# EAGLE design UH_006 (EAGLE 7.3.0)
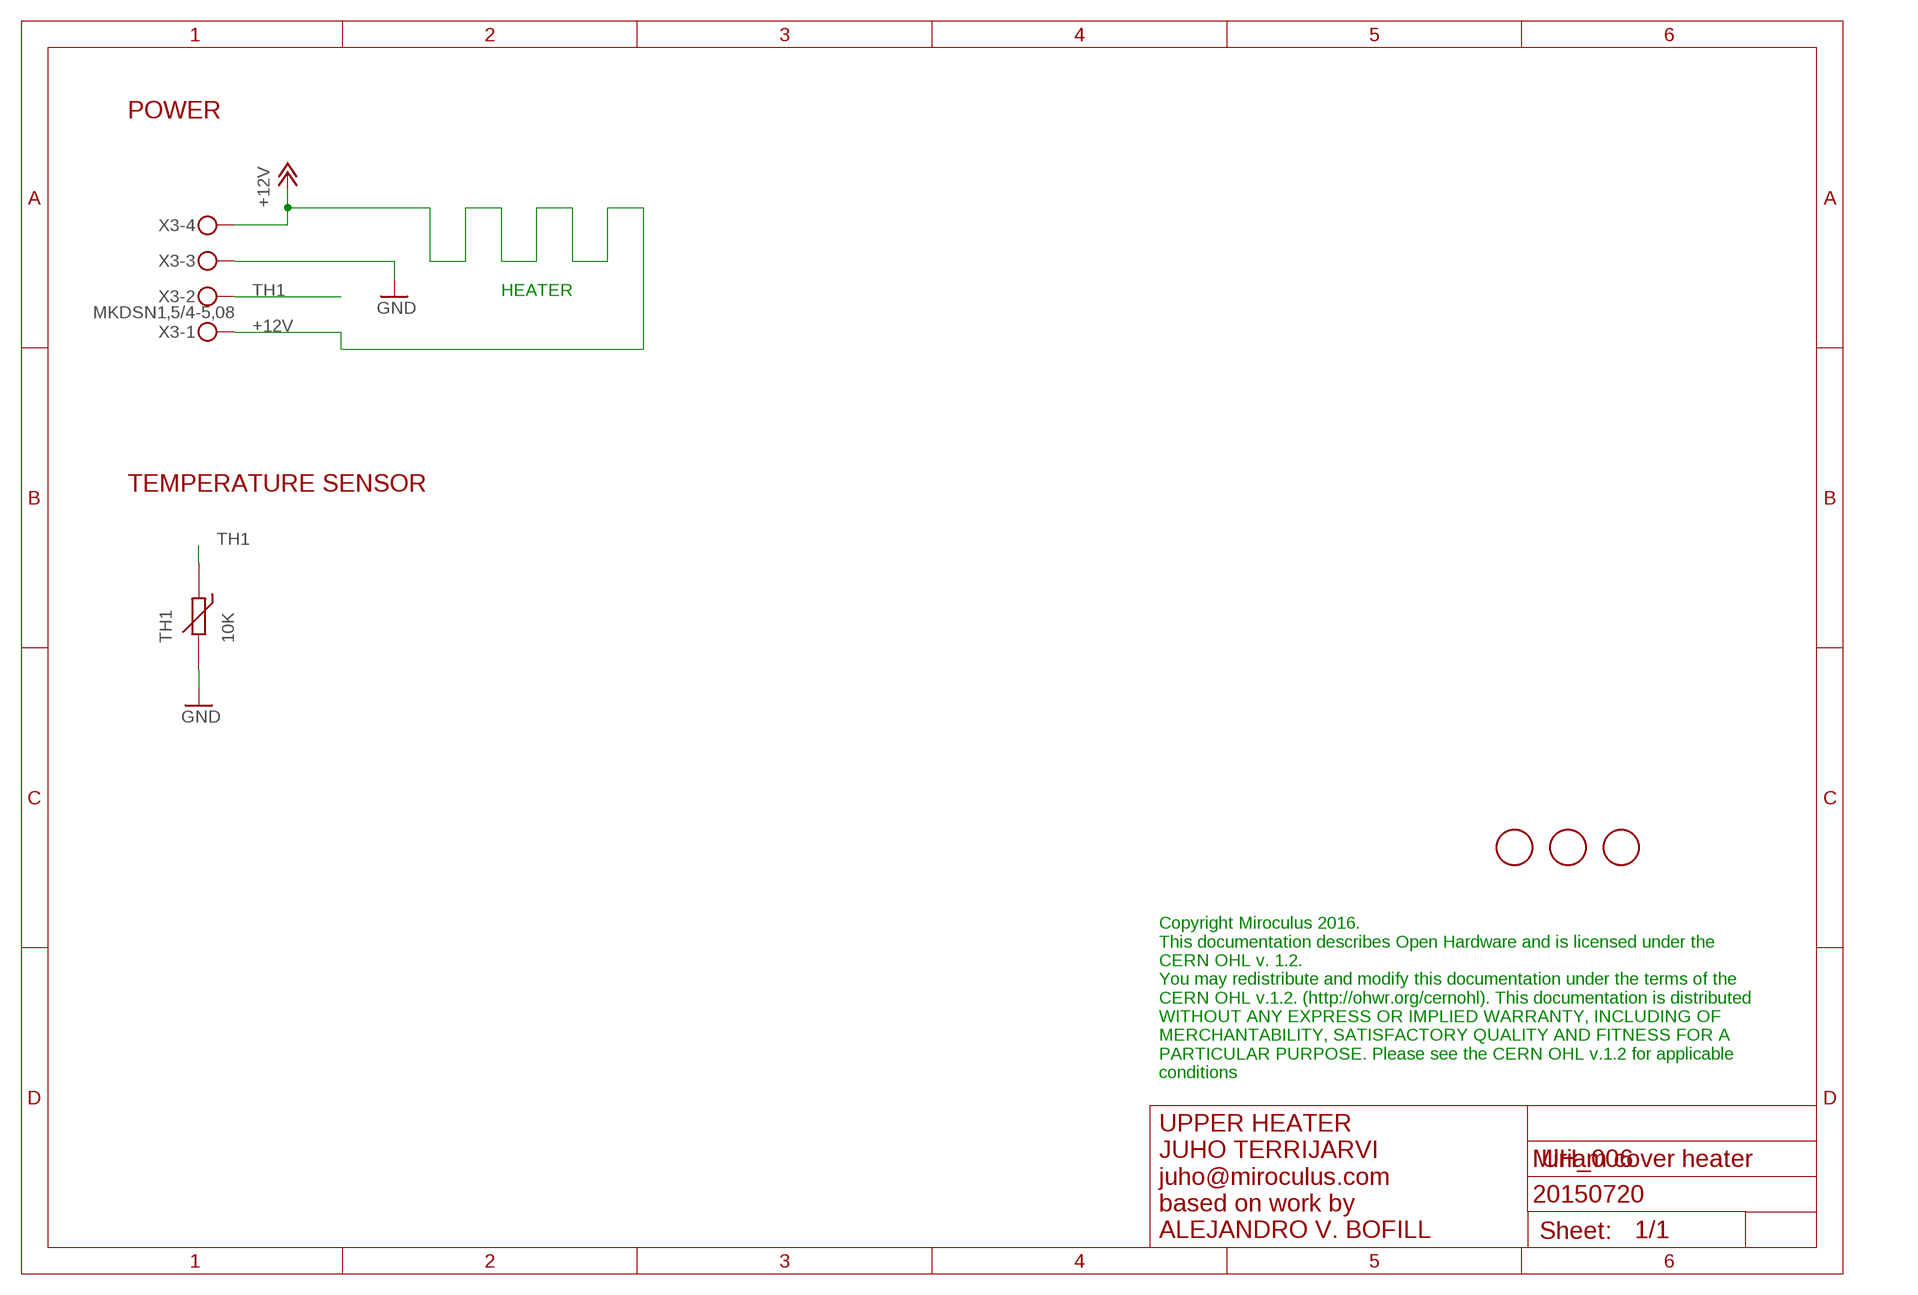
[diagram p0: schematic, sheet 1]

## Parts
FD1  FIDUCIALMOUNT  [FIDUCIA-MOUNT]
FD2  FIDUCIALMOUNT  [FIDUCIA-MOUNT]
FD3  FIDUCIALMOUNT  [FIDUCIA-MOUNT]
TH1  10K  THERMISTOR_SMD_0603  [THERMISTOR_SMD_0603]
X3  MKDSN1,5/4-5,08  [MKDSN1,5/4-5,08]

## Nets
+12V [power12]: X3.1 X3.4
GND: TH1.2 X3.3
TH1: TH1.1 X3.2

## Notes on the sheet
- POWER
- HEATER
- TEMPERATURE SENSOR
- Copyright Miroculus 2016.
  This documentation describes Open Hardware and is licensed under the
  CERN OHL v. 1.2.
  You may redistribute and modify this documentation under the terms of the
  CERN OHL v.1.2. (http://ohwr.org/cernohl). This documentation is distributed
  WITHOUT ANY EXPRESS OR IMPLIED WARRANTY, INCLUDING OF
  MERCHANTABILITY, SATISFACTORY QUALITY AND FITNESS FOR A
  PARTICULAR PURPOSE. Please see the CERN OHL v.1.2 for applicable
  conditions
- UPPER HEATER
  JUHO TERRIJARVI
  juho@miroculus.com
  based on work by
  ALEJANDRO V. BOFILL
- Miriam cover heater
- 20150720

## Library data of the parts
FD1-FD3 = SmartPrj:FIDUCIALMOUNT
TH1 = Miroculus:THERMISTOR_SMD_0603
X3 = con-phoenix-508:MKDSN1,5/4-5,08: MKDSN 1,5/ 4-5,08 Printklemme Nennstrom: 13,5 A Nennspannung: 250 V Rastermaß: 5,08 mm Polzahl: 4 Anschlussart: Schraubanschluss Montage: Löten Anschlussrichtung Leiter/Platine: 0 ° Artikelnummer: 1729144 Source: http://eshop.phoenixcontact.com .. 1729144.pdf

## Net classes
0 default: width 0.254 mm, drill 0.406 mm, clearance 0.178 mm
1 power: width 0.406 mm, drill 0.813 mm, clearance 0.406 mm
2 gnd: width 0.254 mm, drill 0.406 mm, clearance 0.178 mm
3 power usb: width 0.305 mm, drill 0.406 mm, clearance 0.254 mm
4 power12: width 1.778 mm, drill 0.889 mm, clearance 0.406 mm

## Board
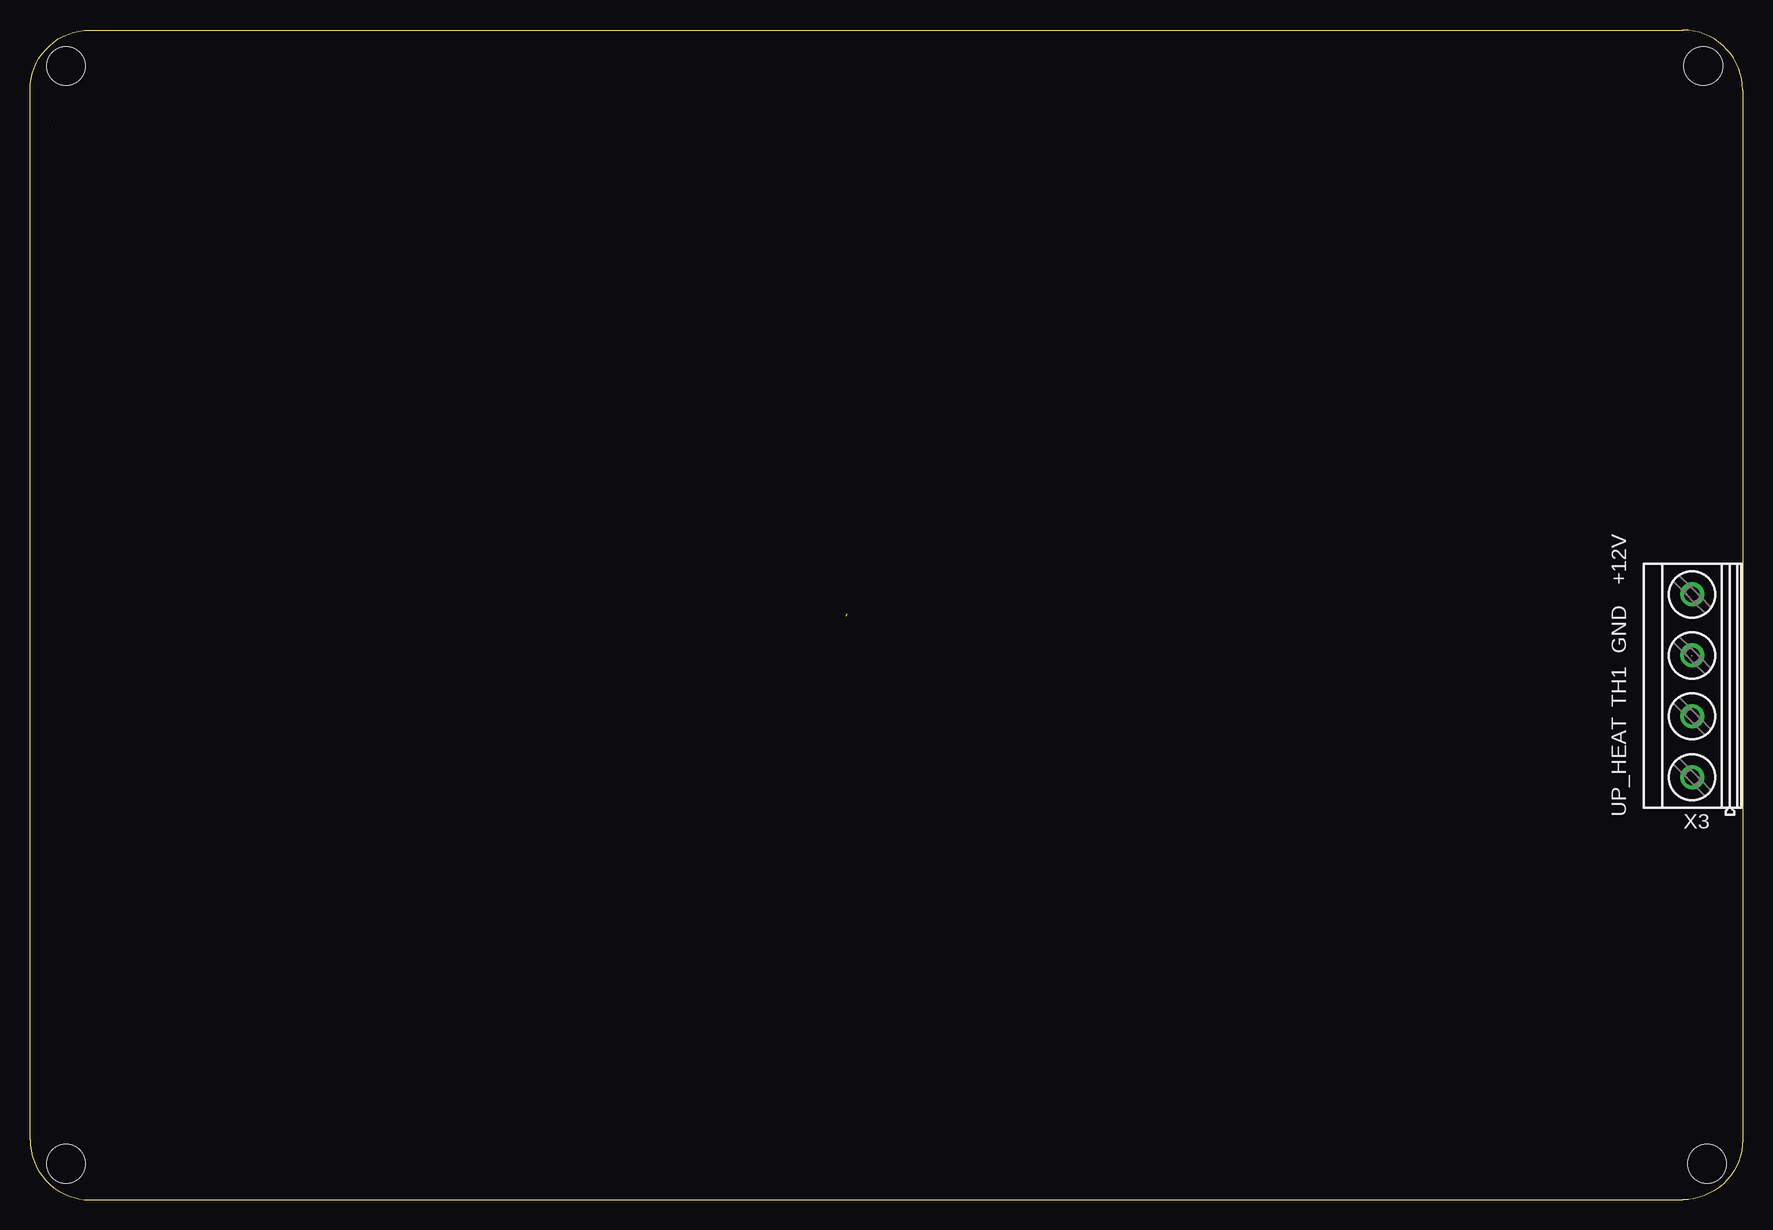
[diagram p1: board, top side]
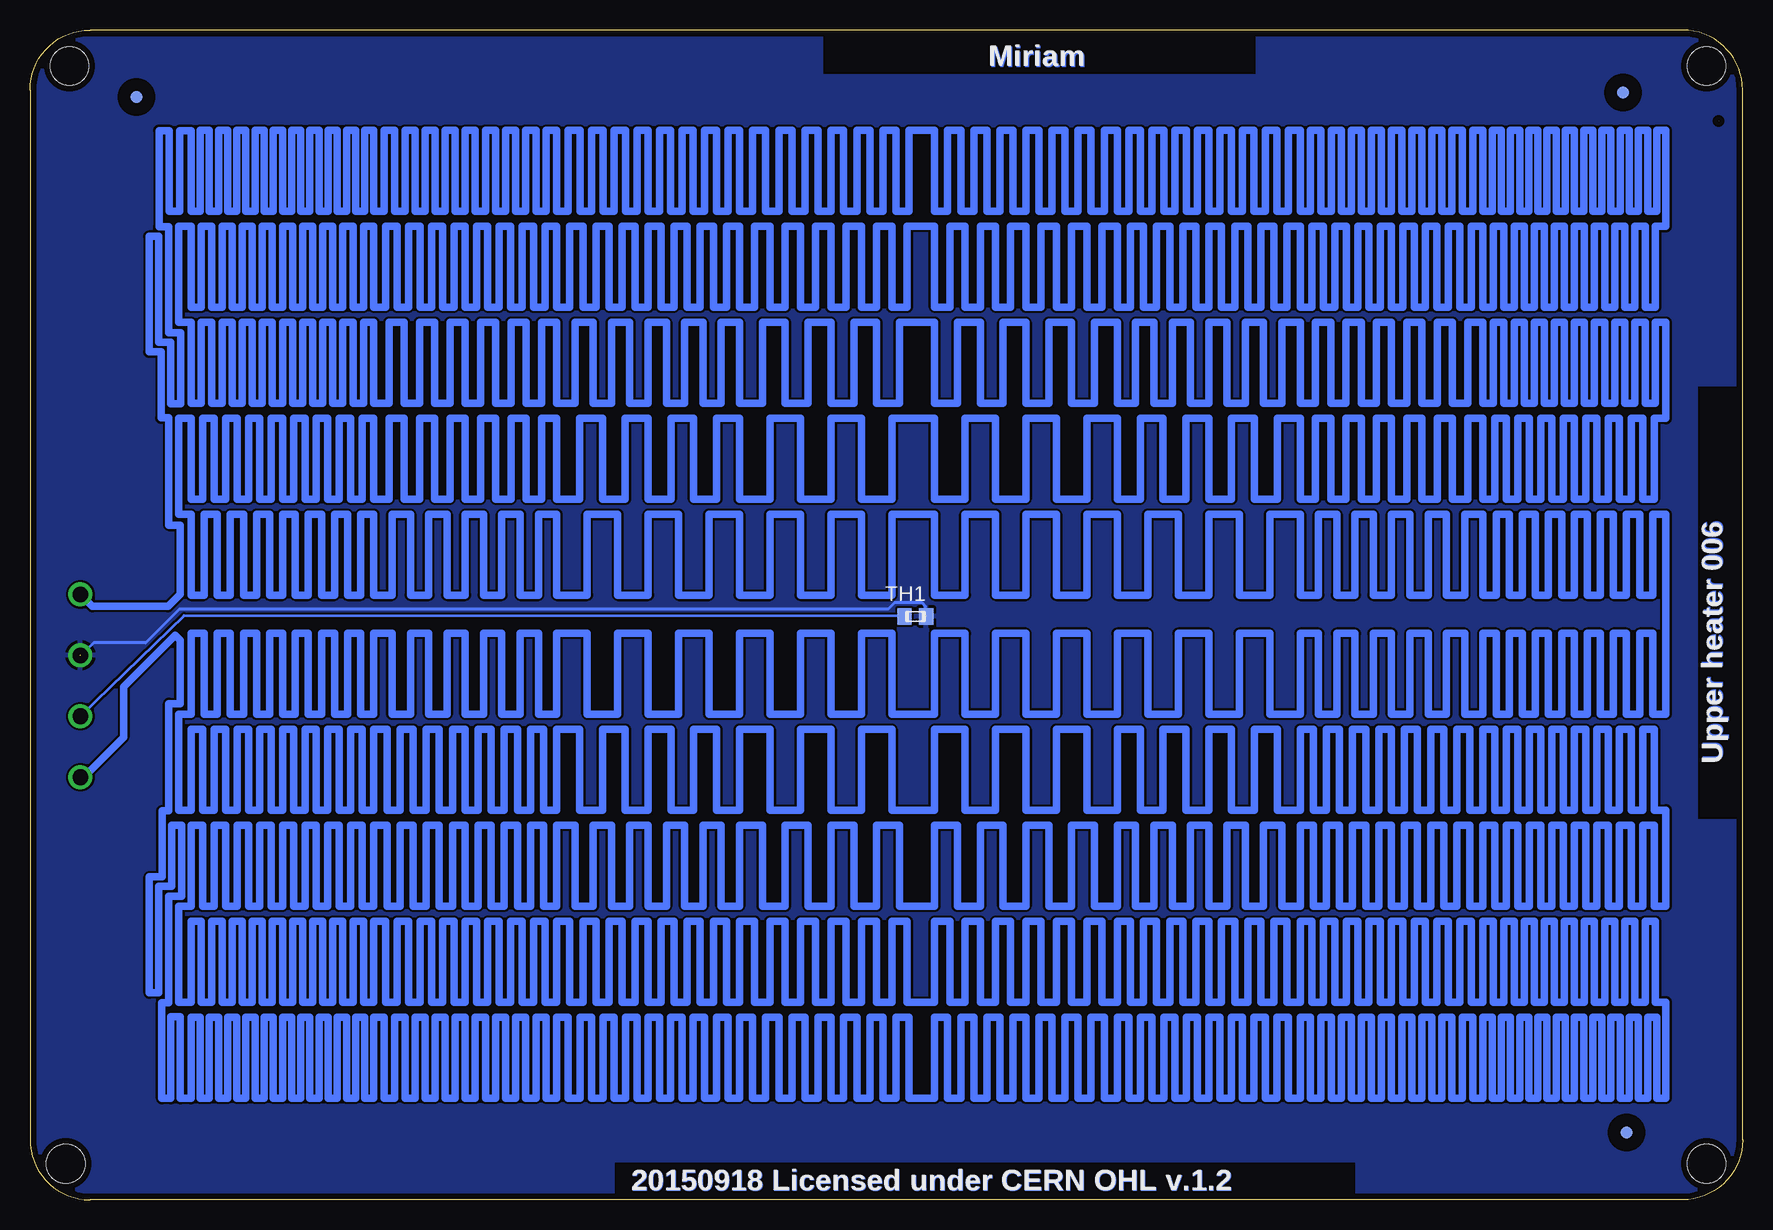
[diagram p2: board, bottom side, seen from below]

Size 142.76 x 97.48 mm. Coordinates in mm from the lower left corner, seen from the top.
Outline: 2.01,89.92 arc0 2.01,89.92
Outline: 0,5 arc90 5,0 137.76,0 arc90 142.76,5 142.76,92.48 arc90 137.76,97.48 5,97.48 arc90 0,92.48 0,5
Copper layers (1*16): Top 0.0178mm / dielectric 59mil / Bottom 0.0178mm
Design rules "SSC-EAGLE-2Lyr_v1.0.0.3": minimum track width 6mil, minimum drill 14mil, track to track 6mil, track to pad 6mil, pad to pad 6mil, via to via 6mil, smd to smd 6mil, copper to edge 20mil, drill to drill 16mil, minimum pad ring 8mil, minimum via ring 8mil, stop-mask expansion 3mil, vias tented up to drill 0mil, thermal gap 10mil
Holes 3.2 mm at 3,94.48 139.48,94.48 139.78,3 3,3
bRestrict: area 40.6,93.8 to 76.6,96.7; area 0.8,31.8 to 3.7,67.7; area 32.3,0.4 to 94,3.1

### Footprints (pad centres in the part's own frame; a part is rotated, then mirrored left to right if it is on the bottom)
FIDUCIA-MOUNT = smd 1.016 x 1.016: P$1 0,0
THERMISTOR_SMD_0603 = smd 1.181 x 1.378: 1 -0.9,0; 2 0.9,0
MKDSN1,5/4-5,08 = drill 1.3 pad 2: 1 -7.641,0.025; 2 -2.561,0.025; 3 2.519,0.025; 4 7.599,0.025

### Placement (x,y rotation side)
FD1  9.67,5.62 0 bottom
FD2  9.96,92.29 0 bottom
FD3  133.89,91.91 0 bottom
TH1  68.96,48.62 0 bottom
X3  138.58,42.85 90 top

### Tracks (layer width: path | path; a pad name or v marks a point on that pad's centre or on a via)
+12V
  Bottom 0.635: X3.1 138.3,35.21 134.95,38.56 134.95,42.75 130.66,47.04 130.23,46.61 130.23,41.35 131.19,41.35 131.19,32.41 131.75,32.41 131.75,26.9 132.82,26.9 132.82,17.25 132.03,17.25 132.03,26.11 130.94,26.11 130.94,31.22 130.12,31.22 130.12,25.3 131.19,25.3 131.19,16.43 131.78,16.43 131.78,8.46 131.01,8.46 131.01,15.24 130.23,15.24 130.23,8.46 129.34,8.46 129.34,15.2 128.57,15.2 128.57,8.47 127.81,8.47 127.81,15.2 127.05,15.2 127.05,8.47 126.29,8.47 126.29,15.2 125.53,15.2 125.53,8.47 124.77,8.47 124.77,15.2 124,15.2 124,8.47 123.24,8.47 123.24,15.2 122.48,15.2 122.48,8.47 121.72,8.47 121.72,15.2 120.95,15.2 120.95,8.47 120.19,8.47 120.19,15.2 119.43,15.2 119.43,8.47 118.67,8.47 118.67,15.2 117.91,15.2 117.91,8.47 117.14,8.47 117.14,15.2 116.38,15.2 116.38,8.47 115.62,8.47 115.62,15.2 114.86,15.2 114.86,8.47 114.1,8.47 114.1,15.2 113.23,15.2 113.23,8.47 112.37,8.47 112.37,15.2 111.51,15.2 111.51,8.47 110.67,8.47 110.67,15.2 109.83,15.2 109.83,8.47 108.99,8.47 108.99,15.2 108.15,15.2 108.15,8.47 107.31,8.47 107.31,15.2 106.48,15.2 106.48,8.47 105.64,8.47 105.64,15.2 104.8,15.2 104.8,8.47 103.96,8.47 103.96,15.2 103.12,15.2 103.12,8.47 102.29,8.47 102.29,15.2 101.45,15.2 101.45,8.47 100.58,8.47 100.58,15.2 99.72,15.2 99.72,8.47 98.86,8.47 98.86,15.2 97.89,15.2 97.89,8.47 96.93,8.47 96.93,15.2 95.96,15.2 95.96,8.47 95,8.47 95,15.2 94.06,15.2 94.06,8.47 93.12,8.47 93.12,15.2 92.18,15.2 92.18,8.47 91.24,8.47 91.24,15.2 90.3,15.2 90.3,8.47 89.36,8.47 89.36,15.2 88.42,15.2 88.42,8.47 87.48,8.47 87.48,15.2 86.51,15.2 86.51,8.47 85.55,8.47 85.55,15.2 84.58,15.2 84.58,8.47 83.62,8.47 83.62,15.2 82.53,15.2 82.53,8.47 81.43,8.47 81.43,15.2 80.34,15.2 80.34,8.47 79.25,8.47 79.25,15.2 78.16,15.2 78.16,8.47 77.06,8.47 77.06,15.2 76,15.2 76,8.47 74.93,8.47 74.93,15.2 73.84,15.2 73.84,8.47 72.75,8.47 72.75,15.2 71.65,15.2 71.65,8.47 70.56,8.47 70.56,15.2 69.47,15.2 69.47,8.47 67.36,8.47 67.36,15.2 66.27,15.2 66.27,8.47 65.18,8.47 65.18,15.2 64.08,15.2 64.08,8.47 62.99,8.47 62.99,15.2 61.9,15.2 61.9,8.47 60.81,8.47 60.81,15.2 59.74,15.2 59.74,8.47 58.67,8.47 58.67,15.2 57.58,15.2 57.58,8.47 56.49,8.47 56.49,15.2 55.4,15.2 55.4,8.47 54.3,8.47 54.3,15.2 53.21,15.2 53.21,8.47 52.12,8.47 52.12,15.2 51.16,15.2 51.16,8.47 50.19,8.47 50.19,15.2 49.23,15.2 49.23,8.47 48.26,8.47 48.26,15.2 47.32,15.2 47.32,8.47 46.38,8.47 46.38,15.2 45.44,15.2 45.44,8.47 44.5,8.47 44.5,15.2 43.56,15.2 43.56,8.47 42.62,8.47 42.62,15.2 41.68,15.2 41.68,8.47 40.74,8.47 40.74,15.2 39.78,15.2 39.78,8.47 38.81,8.47 38.81,15.2 37.85,15.2 37.85,8.47 36.88,8.47 36.88,15.2 36.02,15.2 36.02,8.47 35.15,8.47 35.15,15.2 34.29,15.2 34.29,8.47 33.45,8.47 33.45,15.2 32.61,15.2 32.61,8.47 31.77,8.47 31.77,15.2 30.94,15.2 30.94,8.47 30.1,8.47 30.1,15.2 29.26,15.2 29.26,8.47 28.42,8.47 28.42,15.2 27.58,15.2 27.58,8.47 26.75,8.47 26.75,15.2 25.91,15.2 25.91,8.47 25.07,8.47 25.07,15.2 24.23,15.2 24.23,8.47 23.37,8.47 23.37,15.2 22.5,15.2 22.5,8.47 21.64,8.47 21.64,15.2 20.88,15.2 20.88,8.47 20.12,8.47 20.12,15.2 19.36,15.2 19.36,8.47 18.59,8.47 18.59,15.2 17.83,15.2 17.83,8.47 17.07,8.47 17.07,15.2 16.31,15.2 16.31,8.47 15.54,8.47 15.54,15.2 14.78,15.2 14.78,8.47 14.02,8.47 14.02,15.2 13.26,15.2 13.26,8.47 12.5,8.47 12.5,15.2 11.73,15.2 11.73,8.47 10.97,8.47 10.97,15.2 10.21,15.2 10.21,8.47 9.45,8.47 9.45,15.2 8.69,15.2 8.69,8.47 7.92,8.47 7.92,15.2 7.16,15.2 7.16,8.47 6.4,8.47 6.4,16.47 7.26,16.47 7.26,23.2 8.13,23.2 8.13,16.47 8.99,16.47 8.99,23.2 9.83,23.2 9.83,16.47 10.67,16.47 10.67,23.2 11.51,23.2 11.51,16.47 12.34,16.47 12.34,23.2 13.18,23.2 13.18,16.47 14.02,16.47 14.02,23.2 14.86,23.2 14.86,16.47 15.7,16.47 15.7,23.2 16.54,23.2 16.54,16.47 17.37,16.47 17.37,23.2 18.21,23.2 18.21,16.47 19.05,16.47 19.05,23.2 19.91,23.2 19.91,16.47 20.78,16.47 20.78,23.2 21.64,23.2 21.64,16.47 22.61,16.47 22.61,23.2 23.57,23.2 23.57,16.47 24.54,16.47 24.54,23.2 25.5,23.2 25.5,16.47 26.44,16.47 26.44,23.2 27.38,23.2 27.38,16.47 28.32,16.47 28.32,23.2 29.26,23.2 29.26,16.47 30.2,16.47 30.2,23.2 31.14,23.2 31.14,16.47 32.08,16.47 32.08,23.2 33.02,23.2 33.02,16.47 33.98,16.47 33.98,23.2 34.95,23.2 34.95,16.47 35.92,16.47 35.92,23.2 36.88,23.2 36.88,16.47 37.97,16.47 37.97,23.2 39.06,23.2 39.06,16.47 40.16,16.47 40.16,23.2 41.25,23.2 41.25,16.47 42.34,16.47 42.34,23.2 43.43,23.2 43.43,16.47 44.5,16.47 44.5,23.2 45.57,23.2 45.57,16.47 46.66,16.47 46.66,23.2 47.75,23.2 47.75,16.47 48.84,16.47 48.84,23.2 49.94,23.2 49.94,16.47 51.03,16.47 51.03,23.2 52.12,23.2 52.12,16.47 53.39,16.47 53.39,23.2 54.66,23.2 54.66,16.47 55.93,16.47 55.93,23.2 57.2,23.2 57.2,16.47 58.47,16.47 58.47,23.2 59.74,23.2 59.74,16.47 61.01,16.47 61.01,23.2 62.28,23.2 62.28,16.47 63.55,16.47 63.55,23.2 64.82,23.2 64.82,16.47 66.09,16.47 66.09,23.2 67.36,23.2 67.36,16.47 69.65,16.47 69.65,23.2 70.92,23.2 70.92,16.47 72.19,16.47 72.19,23.2 73.46,23.2 73.46,16.47 74.73,16.47 74.73,23.2 76,23.2 76,16.47 77.27,16.47 77.27,23.2 78.54,23.2 78.54,16.47 79.81,16.47 79.81,23.2 81.08,23.2 81.08,16.47 82.35,16.47 82.35,23.2 83.62,23.2 83.62,16.47 84.71,16.47 84.71,23.2 85.8,23.2 85.8,16.47 86.89,16.47 86.89,23.2 87.99,23.2 87.99,16.47 89.08,16.47 89.08,23.2 90.17,23.2 90.17,16.47 91.24,16.47 91.24,23.2 92.3,23.2 92.3,16.47 93.4,16.47 93.4,23.2 94.49,23.2 94.49,16.47 95.58,16.47 95.58,23.2 96.67,23.2 96.67,16.47 97.77,16.47 97.77,23.2 98.86,23.2 98.86,16.47 99.82,16.47 99.82,23.2 100.79,23.2 100.79,16.47 101.75,16.47 101.75,23.2 102.72,23.2 102.72,16.47 103.66,16.47 103.66,23.2 104.6,23.2 104.6,16.47 105.54,16.47 105.54,23.2 106.48,23.2 106.48,16.47 107.42,16.47 107.42,23.2 108.36,23.2 108.36,16.47 109.3,16.47 109.3,23.2 110.24,23.2 110.24,16.47 111.2,16.47 111.2,23.2 112.17,23.2 112.17,16.47 113.13,16.47 113.13,23.2 114.1,23.2 114.1,16.47 114.96,16.47 114.96,23.2 115.82,23.2 115.82,16.47 116.69,16.47 116.69,23.2 117.53,23.2 117.53,16.47 118.36,16.47 118.36,23.2 119.2,23.2 119.2,16.47 120.04,16.47 120.04,23.2 120.88,23.2 120.88,16.47 121.72,16.47 121.72,23.2 122.56,23.2 122.56,16.47 123.39,16.47 123.39,23.2 124.23,23.2 124.23,16.47 125.07,16.47 125.07,23.2 125.91,23.2 125.91,16.47 126.75,16.47 126.75,23.2 127.61,23.2 127.61,16.47 128.47,16.47 128.47,23.2 129.34,23.2 129.34,16.47 130.35,16.47 130.35,24.47 129.34,24.47 129.34,31.2 128.37,31.2 128.37,24.47 127.41,24.47 127.41,31.2 126.44,31.2 126.44,24.47 125.48,24.47 125.48,31.2 124.54,31.2 124.54,24.47 123.6,24.47 123.6,31.2 122.66,31.2 122.66,24.47 121.72,24.47 121.72,31.2 120.78,31.2 120.78,24.47 119.84,24.47 119.84,31.2 118.9,31.2 118.9,24.47 117.96,24.47 117.96,31.2 116.99,31.2 116.99,24.47 116.03,24.47 116.03,31.2 115.06,31.2 115.06,24.47 114.1,24.47 114.1,31.2 113,31.2 113,24.47 111.91,24.47 111.91,31.2 110.82,31.2 110.82,24.47 109.73,24.47 109.73,31.2 108.64,31.2 108.64,24.47 107.54,24.47 107.54,31.2 106.48,31.2 106.48,24.47 105.41,24.47 105.41,31.2 104.32,31.2 104.32,24.47 103.23,24.47 103.23,31.2 102.13,31.2 102.13,24.47 101.04,24.47 101.04,31.2 99.95,31.2 99.95,24.47 98.86,24.47 98.86,31.2 97.33,31.2 97.33,24.47 95.81,24.47 95.81,31.2 94.28,31.2 94.28,24.47 92.76,24.47 92.76,31.2 91.24,31.2 91.24,24.47 89.71,24.47 89.71,31.2 88.19,31.2 88.19,24.47 86.67,24.47 86.67,31.2 85.14,31.2 85.14,24.47 83.62,24.47 83.62,31.2 81.71,31.2 81.71,24.47 79.81,24.47 79.81,31.2 77.9,31.2 77.9,24.47 76,24.47 76,31.2 74.09,31.2 74.09,24.47 72.19,24.47 72.19,31.2 70.28,31.2 70.28,24.47 67.36,24.47 67.36,31.2 65.46,31.2 65.46,24.47 63.55,24.47 63.55,31.2 61.65,31.2 61.65,24.47 59.74,24.47 59.74,31.2 57.84,31.2 57.84,24.47 55.93,24.47 55.93,31.2 54.03,31.2 54.03,24.47 52.12,24.47 52.12,31.2 50.6,31.2 50.6,24.47 49.07,24.47 49.07,31.2 47.55,31.2 47.55,24.47 46.02,24.47 46.02,31.2 44.5,31.2 44.5,24.47 42.98,24.47 42.98,31.2 41.45,31.2 41.45,24.47 39.93,24.47 39.93,31.2 38.41,31.2 38.41,24.47 36.88,24.47 36.88,31.2 35.79,31.2 35.79,24.47 34.7,24.47 34.7,31.2 33.6,31.2 33.6,24.47 32.51,24.47 32.51,31.2 31.42,31.2 31.42,24.47 30.33,24.47 30.33,31.2 29.26,31.2 29.26,24.47 28.19,24.47 28.19,31.2 27.1,31.2 27.1,24.47 26.01,24.47 26.01,31.2 24.92,31.2 24.92,24.47 23.82,24.47 23.82,31.2 22.73,31.2 22.73,24.47 21.64,24.47 21.64,31.2 20.68,31.2 20.68,24.47 19.71,24.47 19.71,31.2 18.75,31.2 18.75,24.47 17.78,24.47 17.78,31.2 16.84,31.2 16.84,24.47 15.9,24.47 15.9,31.2 14.96,31.2 14.96,24.47 14.02,24.47 14.02,31.2 13.08,31.2 13.08,24.47 12.14,24.47 12.14,31.2 11.2,31.2 11.2,24.47 10.26,24.47 10.26,31.2 9.3,31.2 9.3,24.47 8.33,24.47 8.33,31.2 7.37,31.2 7.37,24.47 6.4,24.47 6.4,32.47 7.37,32.47 7.37,39.2 8.33,39.2 8.33,32.47 9.3,32.47 9.3,39.2 10.26,39.2 10.26,32.47 11.2,32.47 11.2,39.2 12.14,39.2 12.14,32.47 13.08,32.47 13.08,39.2 14.02,39.2 14.02,32.47 14.96,32.47 14.96,39.2 15.9,39.2 15.9,32.47 16.84,32.47 16.84,39.2 17.78,39.2 17.78,32.47 18.75,32.47 18.75,39.2 19.71,39.2 19.71,32.47 20.68,32.47 20.68,39.2 21.64,39.2 21.64,32.47 22.73,32.47 22.73,39.2 23.82,39.2 23.82,32.47 24.92,32.47 24.92,39.2 26.01,39.2 26.01,32.47 27.1,32.47 27.1,39.2 28.19,39.2 28.19,32.47 29.26,32.47 29.26,39.2 30.33,39.2 30.33,32.47 31.42,32.47 31.42,39.2 32.51,39.2 32.51,32.47 33.6,32.47 33.6,39.2 34.7,39.2 34.7,32.47 35.79,32.47 35.79,39.2 36.88,39.2 36.88,32.47 38.79,32.47 38.79,39.2 40.69,39.2 40.69,32.47 42.6,32.47 42.6,39.2 44.5,39.2 44.5,32.47 46.41,32.47 46.41,39.2 48.31,39.2 48.31,32.47 50.22,32.47 50.22,39.2 52.12,39.2 52.12,32.47 54.66,32.47 54.66,39.2 57.2,39.2 57.2,32.47 59.74,32.47 59.74,39.2 62.28,39.2 62.28,32.47 64.82,32.47 64.82,39.2 67.36,39.2 67.36,32.47 70.92,32.47 70.92,39.2 73.46,39.2 73.46,32.47 76,32.47 76,39.2 78.54,39.2 78.54,32.47 81.08,32.47 81.08,39.2 83.62,39.2 83.62,32.47 85.52,32.47 85.52,39.2 87.43,39.2 87.43,32.47 89.33,32.47 89.33,39.2 91.24,39.2 91.24,32.47 93.14,32.47 93.14,39.2 95.05,39.2 95.05,32.47 96.95,32.47 96.95,39.2 98.86,39.2 98.86,32.47 99.95,32.47 99.95,39.2 101.04,39.2 101.04,32.47 102.13,32.47 102.13,39.2 103.23,39.2 103.23,32.47 104.32,32.47 104.32,39.2 105.41,39.2 105.41,32.47 106.48,32.47 106.48,39.2 107.54,39.2 107.54,32.47 108.64,32.47 108.64,39.2 109.73,39.2 109.73,32.47 110.82,32.47 110.82,39.2 111.91,39.2 111.91,32.47 113,32.47 113,39.2 114.1,39.2 114.1,32.47 115.06,32.47 115.06,39.2 116.03,39.2 116.03,32.47 116.99,32.47 116.99,39.2 117.96,39.2 117.96,32.47 118.9,32.47 118.9,39.2 119.84,39.2 119.84,32.47 120.78,32.47 120.78,39.2 121.72,39.2 121.72,32.47 122.66,32.47 122.66,39.2 123.6,39.2 123.6,32.47 124.54,32.47 124.54,39.2 125.48,39.2 125.48,32.47 126.44,32.47 126.44,39.2 127.41,39.2 127.41,32.47 128.37,32.47 128.37,39.2 129.34,39.2 129.34,32.47 130.35,32.47 130.35,40.48 129.34,40.48 129.34,47.21 128.25,47.21 128.25,40.48 127.15,40.48 127.15,47.21 126.06,47.21 126.06,40.48 124.97,40.48 124.97,47.21 123.88,47.21 123.88,40.48 122.78,40.48 122.78,47.21 121.72,47.21 121.72,40.48 120.65,40.48 120.65,47.21 119.56,47.21 119.56,40.48 118.47,40.48 118.47,47.21 117.37,47.21 117.37,40.48 116.28,40.48 116.28,47.21 115.19,47.21 115.19,40.48 114.1,40.48 114.1,47.21 112.57,47.21 112.57,40.48 111.05,40.48 111.05,47.21 109.53,47.21 109.53,40.48 108,40.48 108,47.21 106.48,47.21 106.48,40.48 104.95,40.48 104.95,47.21 103.43,47.21 103.43,40.48 101.91,40.48 101.91,47.21 100.38,47.21 100.38,40.48 98.86,40.48 98.86,47.21 96.32,47.21 96.32,40.48 93.78,40.48 93.78,47.21 91.24,47.21 91.24,40.48 88.7,40.48 88.7,47.21 86.16,47.21 86.16,40.48 83.62,40.48 83.62,47.21 81.08,47.21 81.08,40.48 78.54,40.48 78.54,47.21 76,47.21 76,40.48 73.46,40.48 73.46,47.21 70.92,47.21 70.92,40.48 67.36,40.48 67.36,47.21 64.82,47.21 64.82,40.48 62.28,40.48 62.28,47.21 59.74,47.21 59.74,40.48 57.2,40.48 57.2,47.21 54.66,47.21 54.66,40.48 52.12,40.48 52.12,47.21 49.58,47.21 49.58,40.48 47.04,40.48 47.04,47.21 44.5,47.21 44.5,40.48 41.96,40.48 41.96,47.21 39.42,47.21 39.42,40.48 36.88,40.48 36.88,47.21 35.36,47.21 35.36,40.48 33.83,40.48 33.83,47.21 32.31,47.21 32.31,40.48 30.79,40.48 30.79,47.21 29.26,47.21 29.26,40.48 27.74,40.48 27.74,47.21 26.21,47.21 26.21,40.48 24.69,40.48 24.69,47.21 23.16,47.21 23.16,40.48 21.64,40.48 21.64,47.21 20.55,47.21 20.55,40.48 19.46,40.48 19.46,47.21 18.36,47.21 18.36,40.48 17.27,40.48 17.27,47.21 16.18,47.21 16.18,40.48 15.09,40.48 15.09,47.21 14.02,47.21 14.02,40.48 12.95,40.48 12.95,47.21 11.86,47.21 11.86,40.48 10.77,40.48 10.77,47.21 9.68,47.21 9.68,40.48 8.59,40.48 8.59,47.21 7.49,47.21 7.49,40.48 6.4,40.48 6.4,57.11 7.49,57.11 7.49,50.38 8.59,50.38 8.59,57.11 9.68,57.11 9.68,50.38 10.77,50.38 10.77,57.11 11.86,57.11 11.86,50.38 12.95,50.38 12.95,57.11 14.02,57.11 14.02,50.38 15.09,50.38 15.09,57.11 16.18,57.11 16.18,50.38 17.27,50.38 17.27,57.11 18.36,57.11 18.36,50.38 19.46,50.38 19.46,57.11 20.55,57.11 20.55,50.38 21.64,50.38 21.64,57.11 23.16,57.11 23.16,50.38 24.69,50.38 24.69,57.11 26.21,57.11 26.21,50.38 27.74,50.38 27.74,57.11 29.26,57.11 29.26,50.38 30.79,50.38 30.79,57.11 32.31,57.11 32.31,50.38 33.83,50.38 33.83,57.11 35.36,57.11 35.36,50.38 36.88,50.38 36.88,57.11 39.42,57.11 39.42,50.38 41.96,50.38 41.96,57.11 44.5,57.11 44.5,50.38 47.04,50.38 47.04,57.11 49.58,57.11 49.58,50.38 52.12,50.38 52.12,57.11 54.66,57.11 54.66,50.38 57.2,50.38 57.2,57.11 59.74,57.11 59.74,50.38 62.28,50.38 62.28,57.11 64.82,57.11 64.82,50.38 67.36,50.38 67.36,57.11 70.92,57.11 70.92,50.38 73.46,50.38 73.46,57.11 76,57.11 76,50.38 78.54,50.38 78.54,57.11 81.08,57.11 81.08,50.38 83.62,50.38 83.62,57.11 86.16,57.11 86.16,50.38 88.7,50.38 88.7,57.11 91.24,57.11 91.24,50.38 93.78,50.38 93.78,57.11 96.32,57.11 96.32,50.38 98.86,50.38 98.86,57.11 100.38,57.11 100.38,50.38 101.91,50.38 101.91,57.11 103.43,57.11 103.43,50.38 104.95,50.38 104.95,57.11 106.48,57.11 106.48,50.38 108,50.38 108,57.11 109.53,57.11 109.53,50.38 111.05,50.38 111.05,57.11 112.57,57.11 112.57,50.38 114.1,50.38 114.1,57.11 115.19,57.11 115.19,50.38 116.28,50.38 116.28,57.11 117.37,57.11 117.37,50.38 118.47,50.38 118.47,57.11 119.56,57.11 119.56,50.38 120.65,50.38 120.65,57.11 121.72,57.11 121.72,50.38 122.78,50.38 122.78,57.11 123.88,57.11 123.88,50.38 124.97,50.38 124.97,57.11 126.06,57.11 126.06,50.38 127.15,50.38 127.15,57.11 128.25,57.11 128.25,50.38 129.34,50.38 129.34,57.11 130.35,57.11 130.35,65.11 129.34,65.11 129.34,58.38 128.37,58.38 128.37,65.11 127.41,65.11 127.41,58.38 126.44,58.38 126.44,65.11 125.48,65.11 125.48,58.38 124.54,58.38 124.54,65.11 123.6,65.11 123.6,58.38 122.66,58.38 122.66,65.11 121.72,65.11 121.72,58.38 120.78,58.38 120.78,65.11 119.84,65.11 119.84,58.38 118.9,58.38 118.9,65.11 117.96,65.11 117.96,58.38 116.99,58.38 116.99,65.11 116.03,65.11 116.03,58.38 115.06,58.38 115.06,65.11 114.1,65.11 114.1,58.38 112.83,58.38 112.83,65.11 111.56,65.11 111.56,58.38 110.29,58.38 110.29,65.11 109.02,65.11 109.02,58.38 107.75,58.38 107.75,65.11 106.48,65.11 106.48,58.38 105.21,58.38 105.21,65.11 103.94,65.11 103.94,58.38 102.67,58.38 102.67,65.11 101.4,65.11 101.4,58.38 100.13,58.38 100.13,65.11 98.86,65.11 98.86,58.38 96.95,58.38 96.95,65.11 95.05,65.11 95.05,58.38 93.14,58.38 93.14,65.11 91.24,65.11 91.24,58.38 89.33,58.38 89.33,65.11 87.43,65.11 87.43,58.38 85.52,58.38 85.52,65.11 83.62,65.11 83.62,58.38 81.08,58.38 81.08,65.11 78.54,65.11 78.54,58.38 76,58.38 76,65.11 73.46,65.11 73.46,58.38 70.92,58.38 70.92,65.11 67.36,65.11 67.36,58.38 64.82,58.38 64.82,65.11 62.28,65.11 62.28,58.38 59.74,58.38 59.74,65.11 57.2,65.11 57.2,58.38 54.66,58.38 54.66,65.11 52.12,65.11 52.12,58.38 50.22,58.38 50.22,65.11 48.31,65.11 48.31,58.38 46.41,58.38 46.41,65.11 44.5,65.11 44.5,58.38 42.6,58.38 42.6,65.11 40.69,65.11 40.69,58.38 38.79,58.38 38.79,65.11 36.88,65.11 36.88,58.38 35.61,58.38 35.61,65.11 34.34,65.11 34.34,58.38 33.07,58.38 33.07,65.11 31.8,65.11 31.8,58.38 30.53,58.38 30.53,65.11 29.26,65.11 29.26,58.38 27.99,58.38 27.99,65.11 26.72,65.11 26.72,58.38 25.45,58.38 25.45,65.11 24.18,65.11 24.18,58.38 22.91,58.38 22.91,65.11 21.64,65.11 21.64,58.38 20.68,58.38 20.68,65.11 19.71,65.11 19.71,58.38 18.75,58.38 18.75,65.11 17.78,65.11 17.78,58.38 16.84,58.38 16.84,65.11 15.9,65.11 15.9,58.38 14.96,58.38 14.96,65.11 14.02,65.11 14.02,58.38 13.08,58.38 13.08,65.11 12.14,65.11 12.14,58.38 11.2,58.38 11.2,65.11 10.26,65.11 10.26,58.38 9.3,58.38 9.3,65.11 8.33,65.11 8.33,58.38 7.37,58.38 7.37,65.11 6.4,65.11 6.4,73.11 7.26,73.11 7.26,66.38 8.13,66.38 8.13,73.11 8.99,73.11 8.99,66.38 9.83,66.38 9.83,73.11 10.67,73.11 10.67,66.38 11.51,66.38 11.51,73.11 12.34,73.11 12.34,66.38 13.18,66.38 13.18,73.11 14.02,73.11 14.02,66.38 14.86,66.38 14.86,73.11 15.7,73.11 15.7,66.38 16.54,66.38 16.54,73.11 17.37,73.11 17.37,66.38 18.21,66.38 18.21,73.11 19.05,73.11 19.05,66.38 19.91,66.38 19.91,73.11 20.78,73.11 20.78,66.38 21.64,66.38 21.64,73.11 22.91,73.11 22.91,66.38 24.18,66.38 24.18,73.11 25.45,73.11 25.45,66.38 26.72,66.38 26.72,73.11 27.99,73.11 27.99,66.38 29.26,66.38 29.26,73.11 30.53,73.11 30.53,66.38 31.8,66.38 31.8,73.11 33.07,73.11 33.07,66.38 34.34,66.38 34.34,73.11 35.61,73.11 35.61,66.38 36.88,66.38 36.88,73.11 38.41,73.11 38.41,66.38 39.93,66.38 39.93,73.11 41.45,73.11 41.45,66.38 42.98,66.38 42.98,73.11 44.5,73.11 44.5,66.38 46.02,66.38 46.02,73.11 47.55,73.11 47.55,66.38 49.07,66.38 49.07,73.11 50.6,73.11 50.6,66.38 52.12,66.38 52.12,73.11 54.03,73.11 54.03,66.38 55.93,66.38 55.93,73.11 57.84,73.11 57.84,66.38 59.74,66.38 59.74,73.11 61.65,73.11 61.65,66.38 63.55,66.38 63.55,73.11 65.46,73.11 65.46,66.38 67.36,66.38 67.36,73.11 70.28,73.11 70.28,66.38 72.19,66.38 72.19,73.11 74.09,73.11 74.09,66.38 76,66.38 76,73.11 77.9,73.11 77.9,66.38 79.81,66.38 79.81,73.11 81.71,73.11 81.71,66.38 83.62,66.38 83.62,73.11 85.14,73.11 85.14,66.38 86.67,66.38 86.67,73.11 88.19,73.11 88.19,66.38 89.71,66.38 89.71,73.11 91.24,73.11 91.24,66.38 92.76,66.38 92.76,73.11 94.28,73.11 94.28,66.38 95.81,66.38 95.81,73.11 97.33,73.11 97.33,66.38 98.86,66.38 98.86,73.11 100.13,73.11 100.13,66.38 101.4,66.38 101.4,73.11 102.67,73.11 102.67,66.38 103.94,66.38 103.94,73.11 105.21,73.11 105.21,66.38 106.48,66.38 106.48,73.11 107.75,73.11 107.75,66.38 109.02,66.38 109.02,73.11 110.29,73.11 110.29,66.38 111.56,66.38 111.56,73.11 112.83,73.11 112.83,66.38 114.1,66.38 114.1,73.11 114.96,73.11 114.96,66.38 115.82,66.38 115.82,73.11 116.69,73.11 116.69,66.38 117.53,66.38 117.53,73.11 118.36,73.11 118.36,66.38 119.2,66.38 119.2,73.11 120.04,73.11 120.04,66.38 120.88,66.38 120.88,73.11 121.72,73.11 121.72,66.38 122.56,66.38 122.56,73.11 123.39,73.11 123.39,66.38 124.23,66.38 124.23,73.11 125.07,73.11 125.07,66.38 125.91,66.38 125.91,73.11 126.75,73.11 126.75,66.38 127.61,66.38 127.61,73.11 128.47,73.11 128.47,66.38 129.34,66.38 129.34,73.11 130.35,73.11 130.35,81.11 129.34,81.11 129.34,74.38 128.47,74.38 128.47,81.11 127.61,81.11 127.61,74.38 126.75,74.38 126.75,81.11 125.91,81.11 125.91,74.38 125.07,74.38 125.07,81.11 124.23,81.11 124.23,74.38 123.39,74.38 123.39,81.11 122.56,81.11 122.56,74.38 121.72,74.38 121.72,81.11 120.88,81.11 120.88,74.38 120.04,74.38 120.04,81.11 119.2,81.11 119.2,74.38 118.36,74.38 118.36,81.11 117.53,81.11 117.53,74.38 116.69,74.38 116.69,81.11 115.82,81.11 115.82,74.38 114.96,74.38 114.96,81.11 114.1,81.11 114.1,74.38 113.13,74.38 113.13,81.11 112.17,81.11 112.17,74.38 111.2,74.38 111.2,81.11 110.24,81.11 110.24,74.38 109.3,74.38 109.3,81.11 108.36,81.11 108.36,74.38 107.42,74.38 107.42,81.11 106.48,81.11 106.48,74.38 105.54,74.38 105.54,81.11 104.6,81.11 104.6,74.38 103.66,74.38 103.66,81.11 102.72,81.11 102.72,74.38 101.75,74.38 101.75,81.11 100.79,81.11 100.79,74.38 99.82,74.38 99.82,81.11 98.86,81.11 98.86,74.38 97.77,74.38 97.77,81.11 96.67,81.11 96.67,74.38 95.58,74.38 95.58,81.11 94.49,81.11 94.49,74.38 93.4,74.38 93.4,81.11 92.3,81.11 92.3,74.38 91.24,74.38 91.24,81.11 90.17,81.11 90.17,74.38 89.08,74.38 89.08,81.11 87.99,81.11 87.99,74.38 86.89,74.38 86.89,81.11 85.8,81.11 85.8,74.38 84.71,74.38 84.71,81.11 83.62,81.11 83.62,74.38 82.35,74.38 82.35,81.11 81.08,81.11 81.08,74.38 79.81,74.38 79.81,81.11 78.54,81.11 78.54,74.38 77.27,74.38 77.27,81.11 76,81.11 76,74.38 74.73,74.38 74.73,81.11 73.46,81.11 73.46,74.38 72.19,74.38 72.19,81.11 70.92,81.11 70.92,74.38 69.65,74.38 69.65,81.11 67.36,81.11 67.36,74.38 66.09,74.38 66.09,81.11 64.82,81.11 64.82,74.38 63.55,74.38 63.55,81.11 62.28,81.11 62.28,74.38 61.01,74.38 61.01,81.11 59.74,81.11 59.74,74.38 58.47,74.38 58.47,81.11 57.2,81.11 57.2,74.38 55.93,74.38 55.93,81.11 54.66,81.11 54.66,74.38 53.39,74.38 53.39,81.11 52.12,81.11 52.12,74.38 51.03,74.38 51.03,81.11 49.94,81.11 49.94,74.38 48.84,74.38 48.84,81.11 47.75,81.11 47.75,74.38 46.66,74.38 46.66,81.11 45.57,81.11 45.57,74.38 44.5,74.38 44.5,81.11 43.43,81.11 43.43,74.38 42.34,74.38 42.34,81.11 41.25,81.11 41.25,74.38 40.16,74.38 40.16,81.11 39.06,81.11 39.06,74.38 37.97,74.38 37.97,81.11 36.88,81.11 36.88,74.38 35.92,74.38 35.92,81.11 34.95,81.11 34.95,74.38 33.98,74.38 33.98,81.11 33.02,81.11 33.02,74.38 32.08,74.38 32.08,81.11 31.14,81.11 31.14,74.38 30.2,74.38 30.2,81.11 29.26,81.11 29.26,74.38 28.32,74.38 28.32,81.11 27.38,81.11 27.38,74.38 26.44,74.38 26.44,81.11 25.5,81.11 25.5,74.38 24.54,74.38 24.54,81.11 23.57,81.11 23.57,74.38 22.61,74.38 22.61,81.11 21.64,81.11 21.64,74.38 20.78,74.38 20.78,81.11 19.91,81.11 19.91,74.38 19.05,74.38 19.05,81.11 18.21,81.11 18.21,74.38 17.37,74.38 17.37,81.11 16.54,81.11 16.54,74.38 15.7,74.38 15.7,81.11 14.86,81.11 14.86,74.38 14.02,74.38 14.02,81.11 13.18,81.11 13.18,74.38 12.34,74.38 12.34,81.11 11.51,81.11 11.51,74.38 10.67,74.38 10.67,81.11 9.83,81.11 9.83,74.38 8.99,74.38 8.99,81.11 8.13,81.11 8.13,74.38 7.26,74.38 7.26,81.11 6.4,81.11 6.4,89.12 7.16,89.12 7.16,82.39 7.92,82.39 7.92,89.12 8.69,89.12 8.69,82.39 9.45,82.39 9.45,89.12 10.21,89.12 10.21,82.39 10.97,82.39 10.97,89.12 11.73,89.12 11.73,82.39 12.5,82.39 12.5,89.12 13.26,89.12 13.26,82.39 14.02,82.39 14.02,89.12 14.78,89.12 14.78,82.39 15.54,82.39 15.54,89.12 16.31,89.12 16.31,82.39 17.07,82.39 17.07,89.12 17.83,89.12 17.83,82.39 18.59,82.39 18.59,89.12 19.36,89.12 19.36,82.39 20.12,82.39 20.12,89.12 20.88,89.12 20.88,82.39 21.64,82.39 21.64,89.12 22.5,89.12 22.5,82.39 23.37,82.39 23.37,89.12 24.23,89.12 24.23,82.39 25.07,82.39 25.07,89.12 25.91,89.12 25.91,82.39 26.75,82.39 26.75,89.12 27.58,89.12 27.58,82.39 28.42,82.39 28.42,89.12 29.26,89.12 29.26,82.39 30.1,82.39 30.1,89.12 30.94,89.12 30.94,82.39 31.77,82.39 31.77,89.12 32.61,89.12 32.61,82.39 33.45,82.39 33.45,89.12 34.29,89.12 34.29,82.39 35.15,82.39 35.15,89.12 36.02,89.12 36.02,82.39 36.88,82.39 36.88,89.12 37.85,89.12 37.85,82.39 38.81,82.39 38.81,89.12 39.78,89.12 39.78,82.39 40.74,82.39 40.74,89.12 41.68,89.12 41.68,82.39 42.62,82.39 42.62,89.12 43.56,89.12 43.56,82.39 44.5,82.39 44.5,89.12 45.44,89.12 45.44,82.39 46.38,82.39 46.38,89.12 47.32,89.12 47.32,82.39 48.26,82.39 48.26,89.12 49.23,89.12 49.23,82.39 50.19,82.39 50.19,89.12 51.16,89.12 51.16,82.39 52.12,82.39 52.12,89.12 53.21,89.12 53.21,82.39 54.3,82.39 54.3,89.12 55.4,89.12 55.4,82.39 56.49,82.39 56.49,89.12 57.58,89.12 57.58,82.39 58.67,82.39 58.67,89.12 59.74,89.12 59.74,82.39 60.81,82.39 60.81,89.12 61.9,89.12 61.9,82.39 62.99,82.39 62.99,89.12 64.08,89.12 64.08,82.39 65.18,82.39 65.18,89.12 66.27,89.12 66.27,82.39 67.36,82.39 67.36,89.12 69.47,89.12 69.47,82.39 70.56,82.39 70.56,89.12 71.65,89.12 71.65,82.39 72.75,82.39 72.75,89.12 73.84,89.12 73.84,82.39 74.93,82.39 74.93,89.12 76,89.12 76,82.39 77.06,82.39 77.06,89.12 78.16,89.12 78.16,82.39 79.25,82.39 79.25,89.12 80.34,89.12 80.34,82.39 81.43,82.39 81.43,89.12 82.53,89.12 82.53,82.39 83.62,82.39 83.62,89.12 84.58,89.12 84.58,82.39 85.55,82.39 85.55,89.12 86.51,89.12 86.51,82.39 87.48,82.39 87.48,89.12 88.42,89.12 88.42,82.39 89.36,82.39 89.36,89.12 90.3,89.12 90.3,82.39 91.24,82.39 91.24,89.12 92.18,89.12 92.18,82.39 93.12,82.39 93.12,89.12 94.06,89.12 94.06,82.39 95,82.39 95,89.12 95.96,89.12 95.96,82.39 96.93,82.39 96.93,89.12 97.89,89.12 97.89,82.39 98.86,82.39 98.86,89.12 99.72,89.12 99.72,82.39 100.58,82.39 100.58,89.12 101.45,89.12 101.45,82.39 102.29,82.39 102.29,89.12 103.12,89.12 103.12,82.39 103.96,82.39 103.96,89.12 104.8,89.12 104.8,82.39 105.64,82.39 105.64,89.12 106.48,89.12 106.48,82.39 107.31,82.39 107.31,89.12 108.15,89.12 108.15,82.39 108.99,82.39 108.99,89.12 109.83,89.12 109.83,82.39 110.67,82.39 110.67,89.12 111.51,89.12 111.51,82.39 112.37,82.39 112.37,89.12 113.23,89.12 113.23,82.39 114.1,82.39 114.1,89.12 114.86,89.12 114.86,82.39 115.62,82.39 115.62,89.12 116.38,89.12 116.38,82.39 117.14,82.39 117.14,89.12 117.91,89.12 117.91,82.39 118.67,82.39 118.67,89.12 119.43,89.12 119.43,82.39 120.19,82.39 120.19,89.12 120.95,89.12 120.95,82.39 121.72,82.39 121.72,89.12 122.48,89.12 122.48,82.39 123.24,82.39 123.24,89.12 124,89.12 124,82.39 124.77,82.39 124.77,89.12 125.53,89.12 125.53,82.39 126.29,82.39 126.29,89.12 127.05,89.12 127.05,82.39 127.81,82.39 127.81,89.12 128.57,89.12 128.57,82.39 129.34,82.39 129.34,89.1 130.28,89.1 130.28,82.37 131.17,82.37 131.17,89.1 132,89.1 132,81.1 131.19,81.1 131.19,72.26 130.2,72.26 130.2,66.32 131.04,66.32 131.04,71.45 132.03,71.45 132.03,80.29 132.84,80.29 132.84,70.66 131.83,70.66 131.83,65.15 131.19,65.15 131.19,56.21 130.25,56.21 130.25,50.44 131.24,49.45 137.56,49.45 X3.4
GND  (2 unrouted)
  Bottom 0.254: 68.1,48.82 68.1,49.43 68.4,49.73 70.71,49.73 71.22,49.23 130.3,49.23 133.12,46.41 137.47,46.41 138.53,45.34
  pour Bottom: -9.2,99.72 152.34,100.02 152.74,-6.95 -8.31,-8.95
TH1
  Bottom 0.254: TH1.1 129.92,48.67 X3.2

### Text on the board
Bottom: Miriam | Upper heater 006 | 20150918 Licensed under CERN OHL v.1.2
tPlace: +12V | GND | TH1 | UP_HEAT
bNames: Miriam | Upper heater 006 | 20150918 Licensed under CERN OHL v.1.2